# Altium schematic sheet OMD_AUX.SchDoc
size A0; Organization: Altium Limited; Address1: L3, 12a Rodborough Rd; Address2: Frenchs Forest; Address3: NSW; Address4: Australia 2086
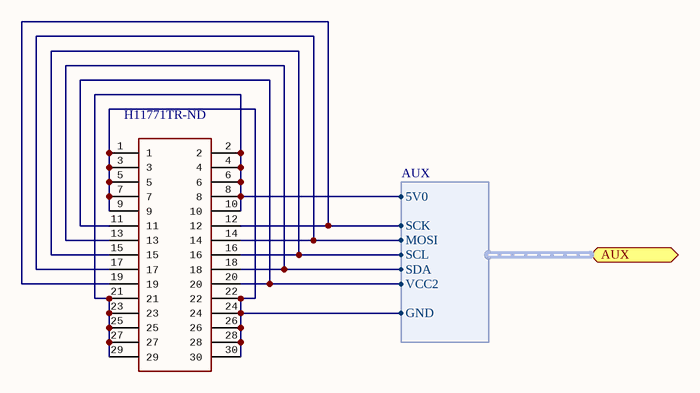
[diagram p0: OMD_AUX.SchDoc]

## Parts
AUX  Supplier Part Number 1: H11771TR-ND  [DF-40C-30DS]  (hidden comment: DF40C-30-DS)

## Ports
AUX (harness AUX)

## Harnesses
AUX: SCK, MOSI, 5V0, GND, SCL, SDA, VCC2

## Nets
NetAUX_1: AUX.1 AUX.3 AUX.5 AUX.7 AUX.9 AUX.22 AUX.24 AUX.26 AUX.28 AUX.30 ; port AUX.GND
NetAUX_2: AUX.2 AUX.4 AUX.6 AUX.8 AUX.10 AUX.21 AUX.23 AUX.25 AUX.27 AUX.29 ; port AUX.5V0
NetAUX_11: AUX.11 AUX.20 ; port AUX.VCC2
NetAUX_12: AUX.12 AUX.19 ; port AUX.SCK
NetAUX_13: AUX.13 AUX.18 ; port AUX.SDA
NetAUX_14: AUX.14 AUX.17 ; port AUX.MOSI
NetAUX_15: AUX.15 AUX.16 ; port AUX.SCL

## Notes on the sheet
- https://github.com/OpenMotorDrive
- Title
- ProfiCNC Pty. Ltd.
- https://creativecommons.org/licenses/by-nc-sa/4.0/
- For Commercial use, please contact ProfiCNC
- ProfiCNC does NOT guaranty these drawings as fit for any purpose, you must verify this information before attempting to use it in any way.  USE AT OWN RISK
- Size:
- Date:
- File:
- A0
- Number:
- Time:
- Revision:
- Sheet
- of

## Library data of the parts
AUX = DF40C-30-DS: CONN RCPT 30POS 0.4MM SMD GOLD; Supplier 1: Digi-Key